# EAGLE design current clamp module (EAGLE 9.6.2)

## Sheet 1 of 2
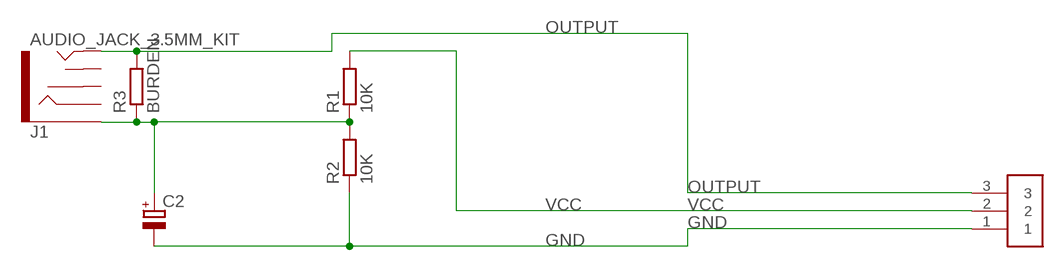
[diagram p0: schematic, sheet 1]

### Parts
ACCURR\  Phoenix Pluggable 3.81mm 3 way  CONNECTOR-M3  [3.81MM-3WAY-PLUGGABLE-SCREW]
C2  CPOL-EUE2.5-6  [E2,5-6]
J1  AUDIO_JACK_3.5MM_KIT  [AUDIO-JACK-KIT]
R1  10K  R-EU_M1206  [M1206]
R2  10K  R-EU_M1206  [M1206]
R3  BURDEN  R-EU_M1206  [M1206]

### Nets
GND: ACCURR\.1 C2.- R2.1 ; also sheet 2
N$5: C2.+ J1.SLEEVE R1.1 R2.2 R3.1
OUTPUT: ACCURR\.3 J1.TIP R3.2
VCC: ACCURR\.2 R1.2
Unconnected: J1.RING J1.RSH J1.TSH

## Sheet 2 of 2
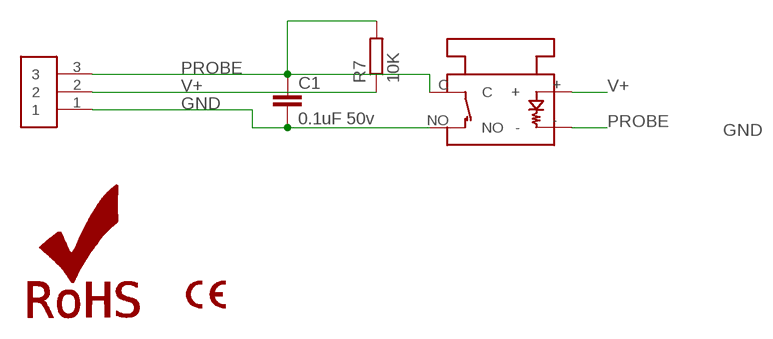
[diagram p1: schematic, sheet 2]

### Parts
C1  0.1uF 50v  C-EUC1206  [C1206]
LOGO1  ROHS_LOGO  [ROHS_LOGO_0.18_IN]
LOGO2  CE-4MM  [CE-4MM]
PROBE  Phoenix Pluggable 3.81mm 3 way  CONNECTOR-M3  [3.81MM-3WAY-PLUGGABLE-SCREW]
R7  10K  R-EU_M1206  [M1206]
U$1  25MMVANDALSWITCH  [25MMVANDALSWITCH]

### Nets
GND: C1.2 PROBE.1 U$1.NO ; also sheet 1
PROBE: C1.1 PROBE.3 R7.2 U$1.- U$1.C
V+: PROBE.2 R7.1 U$1.+

## Library data of the parts
ACCURR\ PROBE = openbuilds-eagle-library:CONNECTOR-M3
C1 = rcl:C-EU: CAPACITOR, European symbol; SPICEPREFIX: C
C2 = rcl:CPOL-EU: POLARIZED CAPACITOR, European symbol; SPICEPREFIX: C
J1 = SparkFun-Connectors:AUDIO_JACK_3.5MM: Audio Jack 3.5mm variants of PTH and SMT stereo audio jack with bypass switches. SparkFun Products: SparkFun SparkPunk Sound Kit <[https://www.sparkfun.com/products/11177]> - PTH MP3 Trigger <https://www.sparkfun.com/products/13720> -3.5mm SMD SparkFun PicoBoard <https://www.sparkfun.com/products/11888>- 2.5mm SMD; PROD_ID: CONN-08774; SF_ID: PRT-08032
LOGO1 = SparkFun-Aesthetics:ROHS_LOGO: Restriction of Hazardous Substances (RoHS) Logo Logo for RoHS-certified hardware.
LOGO2 = ce-logo:CE-4MM
R1-R3 R7 = rcl:R-EU_: RESISTOR, European symbol; SPICEPREFIX: R
U$1 = 25MMVANDALSWITCH:25MMVANDALSWITCH

## Net classes
0 default: width 0.254 mm, clearance 0.152 mm

## Board
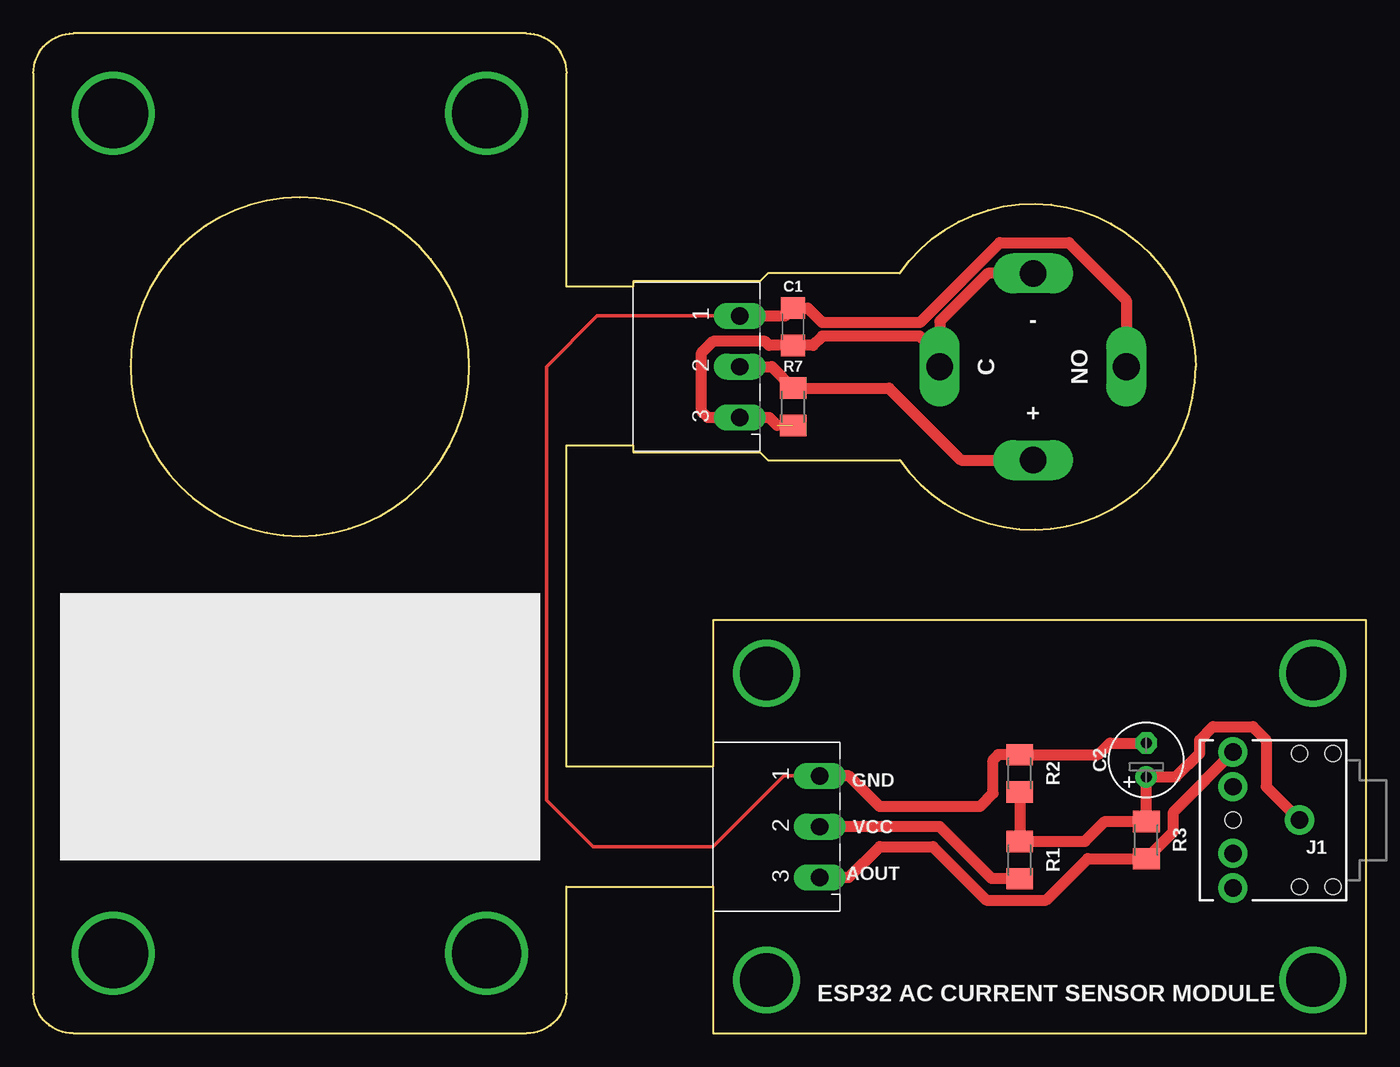
[diagram p2: board, top side]
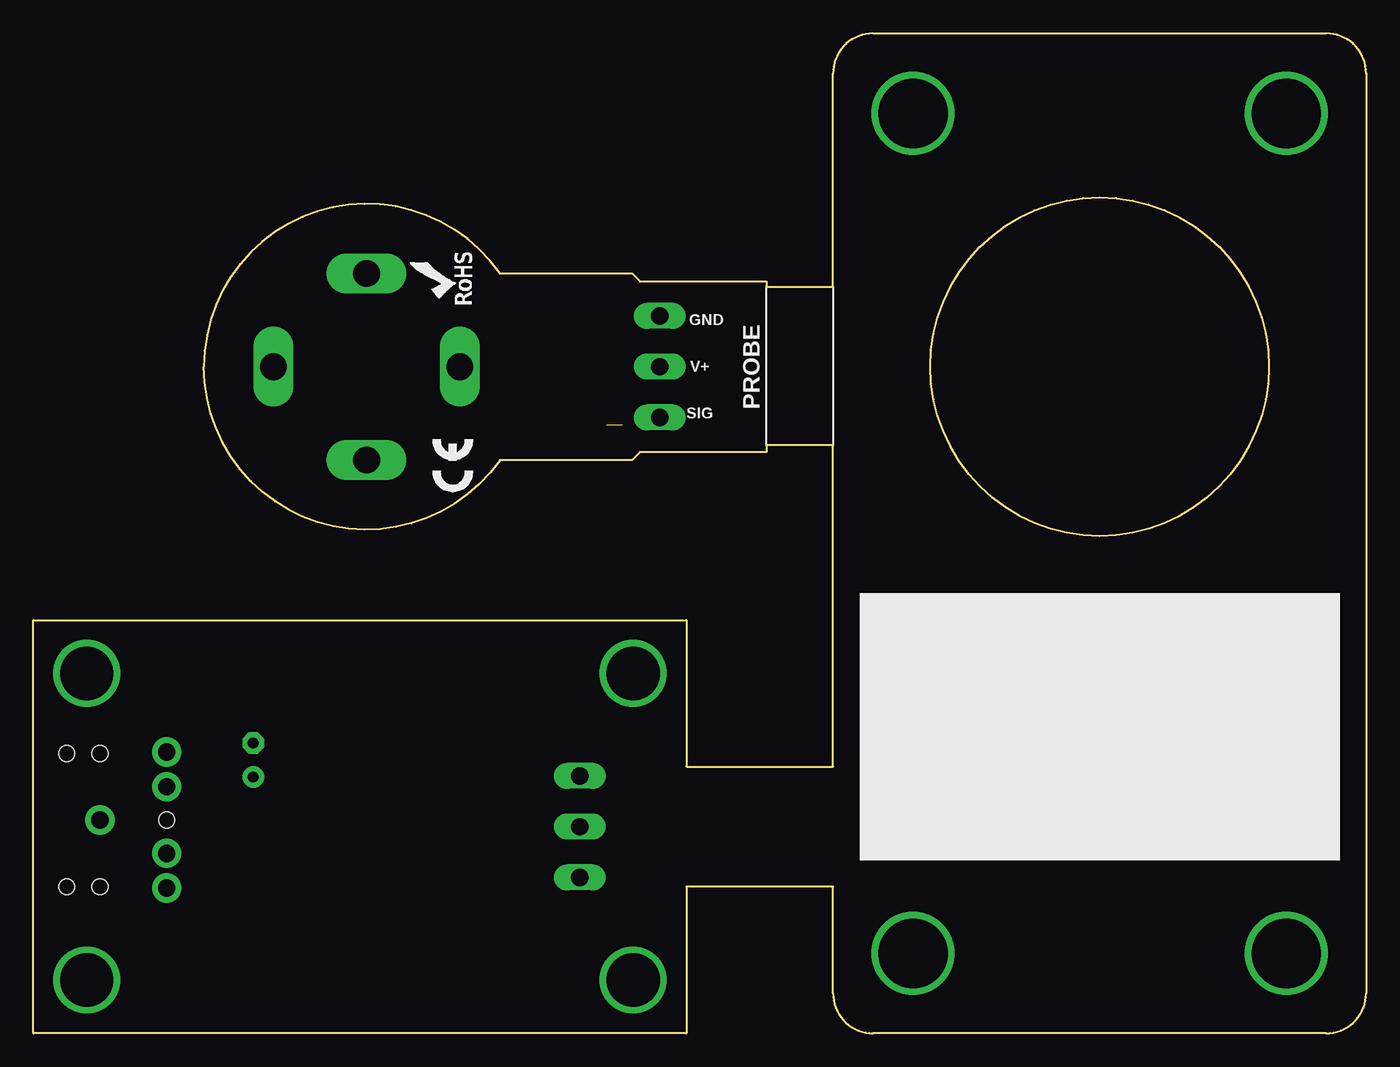
[diagram p3: board, bottom side, seen from below]

Size 100 x 75 mm. Coordinates in mm from the lower left corner, seen from the top.
Outline: 20,37.3 arc180 20,62.7
Outline: 20,62.7 arc180 20,37.3
Outline: 20,62.7 arc180 20,37.3
Outline: 40,3 40,11 51,11 51,0 100,0 100,31 51,31 51,20 40,20 40,44.1 45,44.1 45,43.6 54.5,43.6 55.1,43 65,43 arc145 87.2,50 arc145 65,57 55.1,57 54.5,56.4 45,56.4 45,56 40,56 40,72 arc90 37,75 3,75 arc90 0,72 0,3 arc90 3,0 37,0 arc90 40,3
Copper layers (1*16): Top 0.035mm / dielectric 1.5mm / Bottom 0.035mm
Design rules "default": minimum track width 6mil, minimum drill 0.35mm, track to track 6mil, track to pad 6mil, pad to pad 6mil, via to via 6mil, smd to smd 6mil, copper to edge 40mil, drill to drill 6mil, minimum pad ring 10mil, minimum via ring 8mil, stop-mask expansion 4mil, vias tented up to drill 0mil, thermal gap 10mil

### Footprints (pad centres in the part's own frame; a part is rotated, then mirrored left to right if it is on the bottom)
3.81MM-3WAY-PLUGGABLE-SCREW = drill 1.3 long: 1 -3.81,8; 2 0,8; 3 3.81,8
C1206 = smd 1.6 x 1.8: 1 -1.4,0; 2 1.4,0
E2,5-6 = drill 0.813 pad 1.6: + -1.27,0 | drill 0.813 pad 1.6 octagon: - 1.27,0
AUDIO-JACK-KIT = drill 1.3 pad 2.184: RING 5,5.1; RSH 5,2.5; SLEEVE 0,0; TIP 5,-5.1; TSH 5,-2.5 | hole 1.2: 0,5; -2.5,5; -2.5,-5; 0,-5; 5,0
M1206 = smd 1.6 x 2: 1 -1.4,0; 2 1.4,0
25MMVANDALSWITCH = drill 2 long: + 0,7; - 0,-7; C 7,0; NO -7,0

### Placement (x,y rotation side)
ACCURR\  51,15.5 270 top
C1  57,53 90 top
C2  83.5,20.5 90 top
J1  95,16 180 top
LOGO1  67,54.5 90 bottom
LOGO2  67,40 90 bottom
PROBE  45,50 270 top
R1  74,13 270 top
R2  74,19.5 270 top
R3  83.5,14.5 270 top
R7  57,47 270 top
U$1  75,50 180 top

### Tracks (layer width: path | path; a pad name or v marks a point on that pad's centre or on a via)
GND
  Top 0.254: PROBE.1 42.31,53.81 38.5,50 38.5,17.5 42,14 51,14 56.31,19.31 ACCURR\.1
  Top 0.813: PROBE.1 56.41,53.81 C1.2 58.1,54.4 59.2,53.3 66.5,53.3 72.5,59.3 77.7,59.3 82,55 U$1.NO | C2.- 80.77,21.77 79.9,20.9 R2.1 72.4,20.9 72,20.5 72,18 71,17 63.5,17 61.19,19.31 ACCURR\.1
N$1  (via drill 5.2)
  other vias: 34,6
N$2  (via drill 5.2)
  other vias: 6,6
N$3  (via drill 4)
  other vias: 96,27
N$4  (via drill 5.2)
  other vias: 34,69
N$5
  Top 0.813: R2.2 R1.1 78.9,14.4 80.4,15.9 R3.1 C2.+ 85.73,19.23 87.5,21 87.5,22 88.5,23 91.5,23 92.5,22 92.5,18.5 J1.SLEEVE
N$6  (via drill 5.2)
  other vias: 6,69
N$7  (via drill 4)
  other vias: 55,27
N$8  (via drill 4)
  other vias: 55,4
N$9  (via drill 4)
  other vias: 96,4
OUTPUT
  Top 0.813: J1.TIP 87.97,19.07 87.97,19 85.5,16.54 85.5,15.1 R3.2 79.1,13.1 76,10 71.5,10 67.5,14 63.5,14 61.19,11.69 ACCURR\.3
PROBE  (1 unrouted)
  Top 0.813: C1.1 57.6,51.6 | U$1.- 71.6,57 68,53.4 U$1.C 68,50.8 66.5,52.3 59.2,52.3 58.5,51.6 C1.1 | 55.8,45.6 55.21,46.19 PROBE.3 50.61,46.19 50.1,46.7 50.1,51 51,51.9 54.9,51.9 55.2,51.6 C1.1
V+
  Top 0.813: PROBE.2 55.4,50 R7.1 64.2,48.4 69.6,43 U$1.+
VCC
  Top 0.813: R1.2 71.9,11.6 68,15.5 ACCURR\.2

### Text on the board
tPlace: GND | VCC | AOUT | ESP32 AC CURRENT SENSOR MODULE
bPlace: GND | V+ | SIG